# Altium schematic sheet Sheet1.SchDoc
size A; DrawnBy: Josh Wardell; Organization: MIT; Revision: 1.0; DocumentName: Greybiel Mouseduino
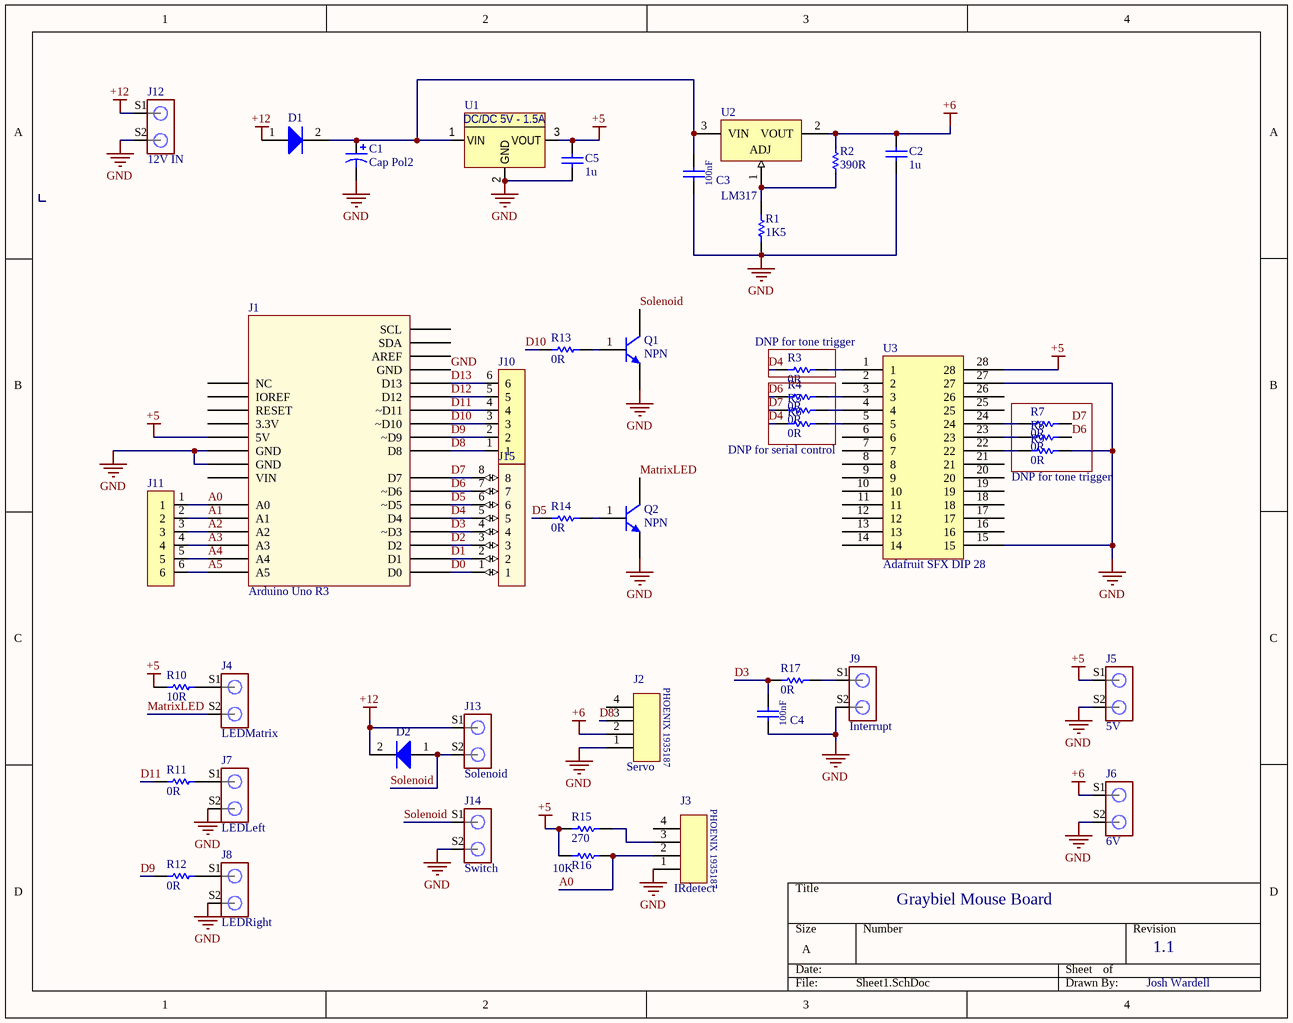
[diagram p0: Sheet1.SchDoc]

## Parts
C1  Cap Pol2  [PCB-xqaiwfy5uu00k2ym2klb-1]
C2  1u  [CAPC2013X135X45ML10T25]
C3  SYM-3c98f6df3913e35f-6  [PCB-ukzk5524dky3o1p8ks6j-1]  (value not drawn)
C4  SYM-3c98f6df3913e35f-6  [PCB-ukzk5524dky3o1p8ks6j-1]  (value not drawn)
C5  1u  [CAPC2013X135X45ML10T25]
D1  SYM-5df394efdd628234-1  [PCB-b6kvxtdabtic7bh9bv58-1]  (value not drawn)
D2  SYM-5df394efdd628234-1  [PCB-b6kvxtdabtic7bh9bv58-1]  (value not drawn)
J1  Arduino Uno R3  [PCB-5e3n8s0ey5jqr2f9nncc-1]
J2  Servo  [PCB-v9l72avc46uddy7fpuqf-1]
J3  IRdetect  [PCB-v9l72avc46uddy7fpuqf-1]
J4  LEDMatrix  [PCB-723450-1]
J5  5V  [PCB-723450-1]
J6  6V  [PCB-723450-1]
J7  LEDLeft  [PCB-723450-1]
J8  LEDRight  [PCB-723450-1]
J9  Interrupt  [PCB-723450-1]
J10  TE Connectivity / AMP 3-644456-5  [PCB-oudem42uhcimrbfznktg-1]  (value not drawn)
J11  TE Connectivity / AMP 3-644456-5  [PCB-oudem42uhcimrbfznktg-1]  (value not drawn)
J12  12V IN  [PCB-723450-1]
J13  Solenoid  [PCB-723450-1]
J14  Switch  [PCB-723450-1]
J15  Samtec TSW-108-07-L-S  [PCB-o70tqi8axh3k6d5wp5n8-1]  (value not drawn)
Q1  NPN  [PCB-7rwmerlkdpdu5vtj8obn-1]
Q2  NPN  [PCB-7rwmerlkdpdu5vtj8obn-1]
R1  Resistance: 1K5  [PCB-lpea0est4zq6qerl2uei-1]  (hidden comment: Res1)
R2  Resistance: 390R  [RESC2013X70X40ML20T20]  (hidden comment: Panasonic ERJ-6ENF1501V)
R3  0R  [RESC2013X65X35NL10T20]
R4  0R  [RESC2013X65X35NL10T20]
R5  0R  [RESC2013X65X35NL10T20]
R6  0R  [RESC2013X65X35NL10T20]
R7  0R  [RESC2013X65X35NL10T20]
R8  0R  [RESC2013X65X35NL10T20]
R9  0R  [RESC2013X65X35NL10T20]
R10  10R  [PCB-tug24or67yk1neb49pkx-1]
R11  0R  [RESC2013X65X35NL10T20]
R12  0R  [RESC2013X65X35NL10T20]
R13  0R  [RESC2013X65X35NL10T20]
R14  0R  [RESC2013X65X35NL10T20]
R15  270  [RESC2013X50X30ML20T20]
R16  10K  [PCB-jmrvwrcl0dwqv7ke6mfz-1]
R17  0R  [RESC2013X65X35NL10T20]
U1  Murata OKI-78SR-5/1.5-W36H-C  [OKI-78SR-5/1.5-W36H-C]  (value not drawn)
U2  LM317  [PCB-d58nmo5dooqatgqjfgwp-1]
U3  Adafruit SFX DIP 28  [PCB-bcfalq7aliu97ymsl87v-1]

## Nets
+5: C5.2 J1.5V J5.S1 R10.2 R15.1 R16.1 U1.3(VOUT) U3.28
+6: C2.2 J2.2 J6.S1 R2.2 U2.2(VOUT)
+12: D1.1(+) D2.2(-) J12.S1 J13.S1
GND: C1.2 C2.1 C3.1 C4.1 C5.1 J1.GND1(GND) J1.GND2(GND) J1.GND3(GND) J2.1 J3.1 J5.S2 J6.S2 J7.S2 J8.S2 J9.S2 J12.S2 J14.S2 Q1.3(E) Q2.3(E) R1.1 R9.2 U1.2(GND) U3.15 U3.27
A0: J1.A0 J3.2 J11.1 R16.2
A1: J1.A1 J11.2
A2: J1.A2 J11.3
A3: J1.A3 J11.4
A4: J1.A4 J11.5
A5: J1.A5 J11.6
D0: J1.D0 J15.1
D1: J1.D1 J15.2
D2: J1.D2 J15.3
D3: C4.2 J1.D3(~D3) J15.4 R17.1
D4: J1.D4 J15.5 R3.1 R6.1
D5: J1.D5(~D5) J15.6 R14.1
D6: J1.D6(~D6) J15.7 R4.1 R8.2
D7: J1.D7 J15.8 R5.1 R7.2
D8: J1.D8 J2.3 J10.1
D9: J1.D9(~D9) J10.2 R12.1
D10: J1.D10(~D10) J10.3 R13.1
D11: J1.D11(~D11) J10.4 R11.1
D12: J1.D12 J10.5
D13: J1.D13 J10.6
MatrixLED: J4.S2 Q2.2(C)
Solenoid: D2.1(+) J13.S2 J14.S1 Q1.2(C)
NetC1_1: C1.1 C3.2 D1.2(-) U1.1(VIN) U2.3(VIN)
NetJ3_3: J3.3 R15.2
NetJ4_S1: J4.S1 R10.1
NetJ7_S1: J7.S1 R11.2
NetJ8_S1: J8.S1 R12.2
NetJ9_S1: J9.S1 R17.2
NetQ1_1: Q1.1(B) R13.2
NetQ2_1: Q2.1(B) R14.2
NetR1_2: R1.2 R2.1 U2.1(ADJ)
NetR3_2: R3.2 U3.1
NetR4_2: R4.2 U3.3
NetR5_2: R5.2 U3.4
NetR6_2: R6.2 U3.5
NetR7_1: R7.1 U3.24
NetR8_1: R8.1 U3.23
NetR9_1: R9.1 U3.22

Not connected (* = marked no-connect by the designer): J1 3.3V AREF IOREF NC RESET SCL SDA VIN; J2 4; J3 4; U3 2 6 7 8 9 10 11 12 13 14 16 17 18 19 20 21 25 26

## Notes on the sheet
- DNP for tone trigger
- DNP for serial control
- Graybiel Mouse Board
- 1.1
- Josh Wardell
- (in symbol CMP-3c98f6df3913e35f-15) 100nF
- (in symbol CMP-3191555-6) DC/DC 5V - 1.5A
- (in symbol CMP-f0b139bb75412f76-5) PHOENIX 1935187

## Library data of the parts
C1 = CMP-07bcccec45f2d87b-1: Capacitor; Alum Electrolytic; Cap 100 uF; Tol 20%; Vol-Rtg 25 VDC; Radial; 8x11.5; Bulk; Manufacturer Part Number: ECE-A1EN101U; Lifecycle Status: Not Listed by Manufacturer; REACH SVHC Compliance: No SVHC; Capacitance Tolerance: ±20%; OctopartID: 07bcccec45f2d87b
C2 C5 = CMP-135130-2: CAP CER 1UF 16V 10% X7R 0805; Capacitance: 1e-06 F; Case/Package (SI): 2012; Lead-Free Status: Lead Free; Voltage Rating (DC): 16.0 V; Capacitance Tolerance: ±10%; Case/Package: 0805; Dielectric Characteristic: X7R; Lifecycle Status: Active; Octopart Url: https://octopart.com/grm21br71c105ka01k-murata-8115590; OctopartID: 8db044c17d505277; RoHS: Compliant; Size-Length: 0.002 m; Size-Thickness: 0.00125 m; Size-Width: 0.00125 m
C3 C4 = CMP-3c98f6df3913e35f-15: Capacitor; Ceramic; Cap 0.1 uF; Tol 10%; Vol-Rtg 50 VDC; SMT; 0805; X7R; Cut Tape; Manufacturer Part Number: 08055C104KAT2A; Voltage Rating (DC): 50.0 V; Capacitance: 100 nF; Mounting Style: Surface Mount; Dielectric Material: Ceramic; Number of Pins: 2; REACH SVHC Compliance: No SVHC; Size-Height: 940 µm; Capacitance Tolerance: ±10%; Octopart URL: http://octopart.com/08055c104kat2a-avx-55386349; RoHS: Compliant; Case/Package: 0805; Size-Width: 1.24 mm
D1 D2 = CMP-5df394efdd628234-2: Rectifier diode [Diotec] 1N4004 Rectifier diode; Voltage Rating (DC): 400 V; Number of Pins: 2
J1 = CMP-1073962-46: Microcontroller board, Uno [Arduino] A000066 Microcontroller board, Uno 7640152110092; Number of Bits: 8; Core Architecture: AVR; RoHS: Compliant; Manufacturer Part Number: A000066; Octopart URL: http://octopart.com/a000066-arduino-21222240; OctopartID: aa24626d5c2275e3; REACH SVHC Compliance: No SVHC
J2 J3 = CMP-f0b139bb75412f76-5: Screw terminal 2.50 mm² Number of pins 4 PT 1, 5/ 4-5, 0-H Phoenix Contact Green 1 pc(s); RoHS: Compliant; Housing Material: Nylon; Mounting Style: Through Hole, Screw; Size-Width: 9.00 mm; Size-Length: 20.0 mm; Insulation Material: Nylon; Size-Height: 11.4 mm
J4-J9 J12-J14 = CMP-723450-4: TERM BLOCK HEADER 2POS 5MM BLACK; Lead-Free Status: Lead Free; Mounting Angle: 180.0 °; Number of Positions: 2; Pin Pitch: 0.005 m; Voltage Rating (DC): 400.0 V; Flammability Rating: UL 94 V-0; Housing Color: Black; Housing Material: Nylon; Insulation Material: Nylon; Number of Rows: 1; Octopart Url: https://octopart.com/1933189-phoenix+contact-119061; OctopartID: 3f7bf670cb08e0bc; RoHS: Compliant; Size-Height: 0.013 m; Size-Length: 0.01 m
J10 J11 = CMP-7ab1b1e1ad8ca576-9: MTA-100 Series 6 Position 2.54 mm Pitch Single Row Tin Plated Header; Lead-Free Status: Lead Free; Gender: Male; Mounting Angle: 180 °; ELV Compliant: Compliant; Voltage Rating (AC): 250 V; Shrouded: No; Number of Positions: 6; RoHS: Compliant; Housing Color: Natural; Flammability Rating: UL 94 V-0; Lifecycle Status: Active; Size-Width: 2.34 mm; Mounting Style: Through Hole, Vertical; OctopartID: 7ab1b1e1ad8ca576; Orientation: Vertical; Octopart URL: http://octopart.com/3-644456-6-te+connectivity+%2F+amp-39514715; Number of Rows: 1; Housing Material: Polyester; Number of Contacts: 6; Contact Material: Copper Alloy; Contact Plating: Tin
J15 = CMP-69fea0f06b37b639-1: HEADER, 2.54MM, THT VERT, 8POS; Series: TSW; Pitch Spacing: 2.54mm; No. of Rows: 1;; Number of Positions: 8; Gender: Male; Lead-Free Status: Lead Free; Octopart URL: http://octopart.com/tsw-108-07-l-s-samtec-272303; Manufacturer Part Number: TSW-108-07-L-S; OctopartID: 69fea0f06b37b639; Contact Plating: Gold; Number of Rows: 1; Contact Material: Phosphor Bronze; Housing Color: Black; Size-Width: 2.54 mm; REACH SVHC Compliance: No SVHC; Size-Length: 20.3 mm; Pin Pitch: 2.54 mm; Number of Contacts: 8; Size-Height: 2.54 mm; RoHS: Compliant; Housing Material: Plastic; Mounting Style: Through Hole
Q1 Q2 = CMP-3d84f48b638ce243-2: Trans Darlington NPN 60V 5A 2000mW Automotive 3-Pin(3+Tab) TO-220AB Bag; Manufacturer Part Number: TIP120; Voltage Rating (DC): 60.0 V; Power Dissipation: 2.00 W; RoHS: Compliant; Octopart URL: http://octopart.com/tip120-fairchild+semiconductor-359278; Lifecycle Status: Active; Case/Package: TO-220; Packaging: Tube
R1 = CMP-7c05b642f7a2a3c2-1: Precision resistor, SMD [Panasonic Automotive & Industrial Systems] ERJ6ENF3900V Precision resistor, SMD; Manufacturer Part Number: ERJ-6ENF3900V; Voltage Rating (DC): 150 V; Case/Package (SI): 2012; Resistance Tolerance: ±1%; Power Rating: 125 mW; Case/Package: 0805; Mounting Style: Surface Mount; REACH SVHC Compliance: No SVHC; Packaging: Tape & Reel (TR), Cut Tape (CT); OctopartID: 7c05b642f7a2a3c2; Lifecycle Status: Not Listed by Manufacturer; RoHS: Compliant; Octopart URL: http://octopart.com/erj-6enf3900v-panasonic-55422657
R2 = CMP-3652227-3: Thick Film Resistors 0805 1.5Kohms 1% Tol; Lead-Free Status: Lead Free; Voltage Rating (DC): 150.0 V; Power Rating: 0.125 W; Case/Package (SI): 2012; Resistance Tolerance: ±1%; Size-Width: 0.00125 m; Size-Height: 0.0006 m; Number of Pins: 2; REACH SVHC Compliance: No SVHC; Lifecycle Status: Not Listed by Manufacturer; Octopart Url: https://octopart.com/erj-6enf1501v-panasonic-55422416; Size-Length: 0.002 m; Mounting Style: Surface Mount; OctopartID: 56ae9ce9de188969; RoHS: Compliant; Packaging: Cut Tape (CT); Case/Package: 0805
R3-R9 R11-R14 R17 = CMP-16524377-4: Panasonic Resistor 0 Ohm 0805; Manufacturer Part Number: ERJ-6GEY0R00V; Lead-Free Status: Lead Free; Power Rating: 0.125 W; Voltage Rating (DC): 150.0 V; Resistance: 0.0 Ω; Case/Package (SI): 2012; Resistance Tolerance: ±5%; RoHS: Compliant; Size-Width: 0.00125 m; Manufacturer: Panasonic; Lifecycle Status: Not Listed by Manufacturer; REACH SVHC Compliance: No SVHC; Size-Height: 0.0006 m; Octopart Url: https://octopart.com/erj-6gey0r00v-panasonic-55405059; Mounting Style: Surface Mount; Packaging: Cut Tape (CT); Size-Length: 0.002 m; OctopartID: a3d8699fecbd7c1f
R10 = CMP-196dd32a6f1ac6aa-1: Surface Mount Chip Resistor, Thick Film, CRS Series, 10 ohm, 1 W, 5%, 400 V, 2010 [5025 Metric]; Manufacturer Part Number: CRS2010-JX-100ELF; Power Rating: 1.00 W; Resistance: 10.0 Ω; RoHS: Compliant; REACH SVHC Compliance: No SVHC; Case/Package: 2010; Packaging: Cut Tape (CT)
R15 = CMP-10770253-4: Thick film resistor; Case/Package (SI): 2012; Lead-Free Status: Lead Free; Power Rating: 0.125 W; Resistance: 270.0 Ω; Resistance Tolerance: ±1%; Voltage Rating (DC): 150.0 V; Case/Package: 0805; Mounting Style: Surface Mount; Number of Pins: 2; Octopart Url: https://octopart.com/crcw0805270rfkea-vishay-39861129; OctopartID: 6f95a4ff717ab052; REACH SVHC Compliance: No SVHC; RoHS: Compliant; Size-Height: 0.00045 m; Size-Length: 0.002 m; Size-Width: 0.00125 m
R16 = CMP-4716692-8: Res Thick Film 0805 10K Ohm 1% 0.125W(1/8W) ±100ppm/C Molded SMD Automotive Paper T/R; Lead-Free Status: Lead Free; Case/Package (SI): 2012; Resistance Tolerance: ±1%; Mounting Style: Surface Mount
U1 = CMP-3191555-6: DC/DC Converters 7.5W 24V 5Vout 1.5A Horizontal Mount; Lead-Free Status: Lead Free; Octopart Url: https://octopart.com/oki-78sr-5%2F1.5-w36h-c-murata+power+solutions-49451315; RoHS: Compliant; OctopartID: 0bf9c001bfacd43e
U2 = CMP-bbed72e7deae642a-4: 1.5 A Adjustable Output, Positive Voltage Regulator, 0 to 125 degC, 3-Pin TO-220 (221AB-01), Pb-Free, Rail
U3 = CMP-4t4546zhglsm7c6ybtqr-1: Adafruit Audio FX Sound Board - WAV/OGG Trigger with 2MB Flash; Manufacturer Part Number: 2133; Manufacturer: Adafruit; Homepage URL: https://www.adafruit.com/product/2133; CustomComponentID: 4t4546zhglsm7c6ybtqr